# EAGLE board light_controller (EAGLE 8.5.0)
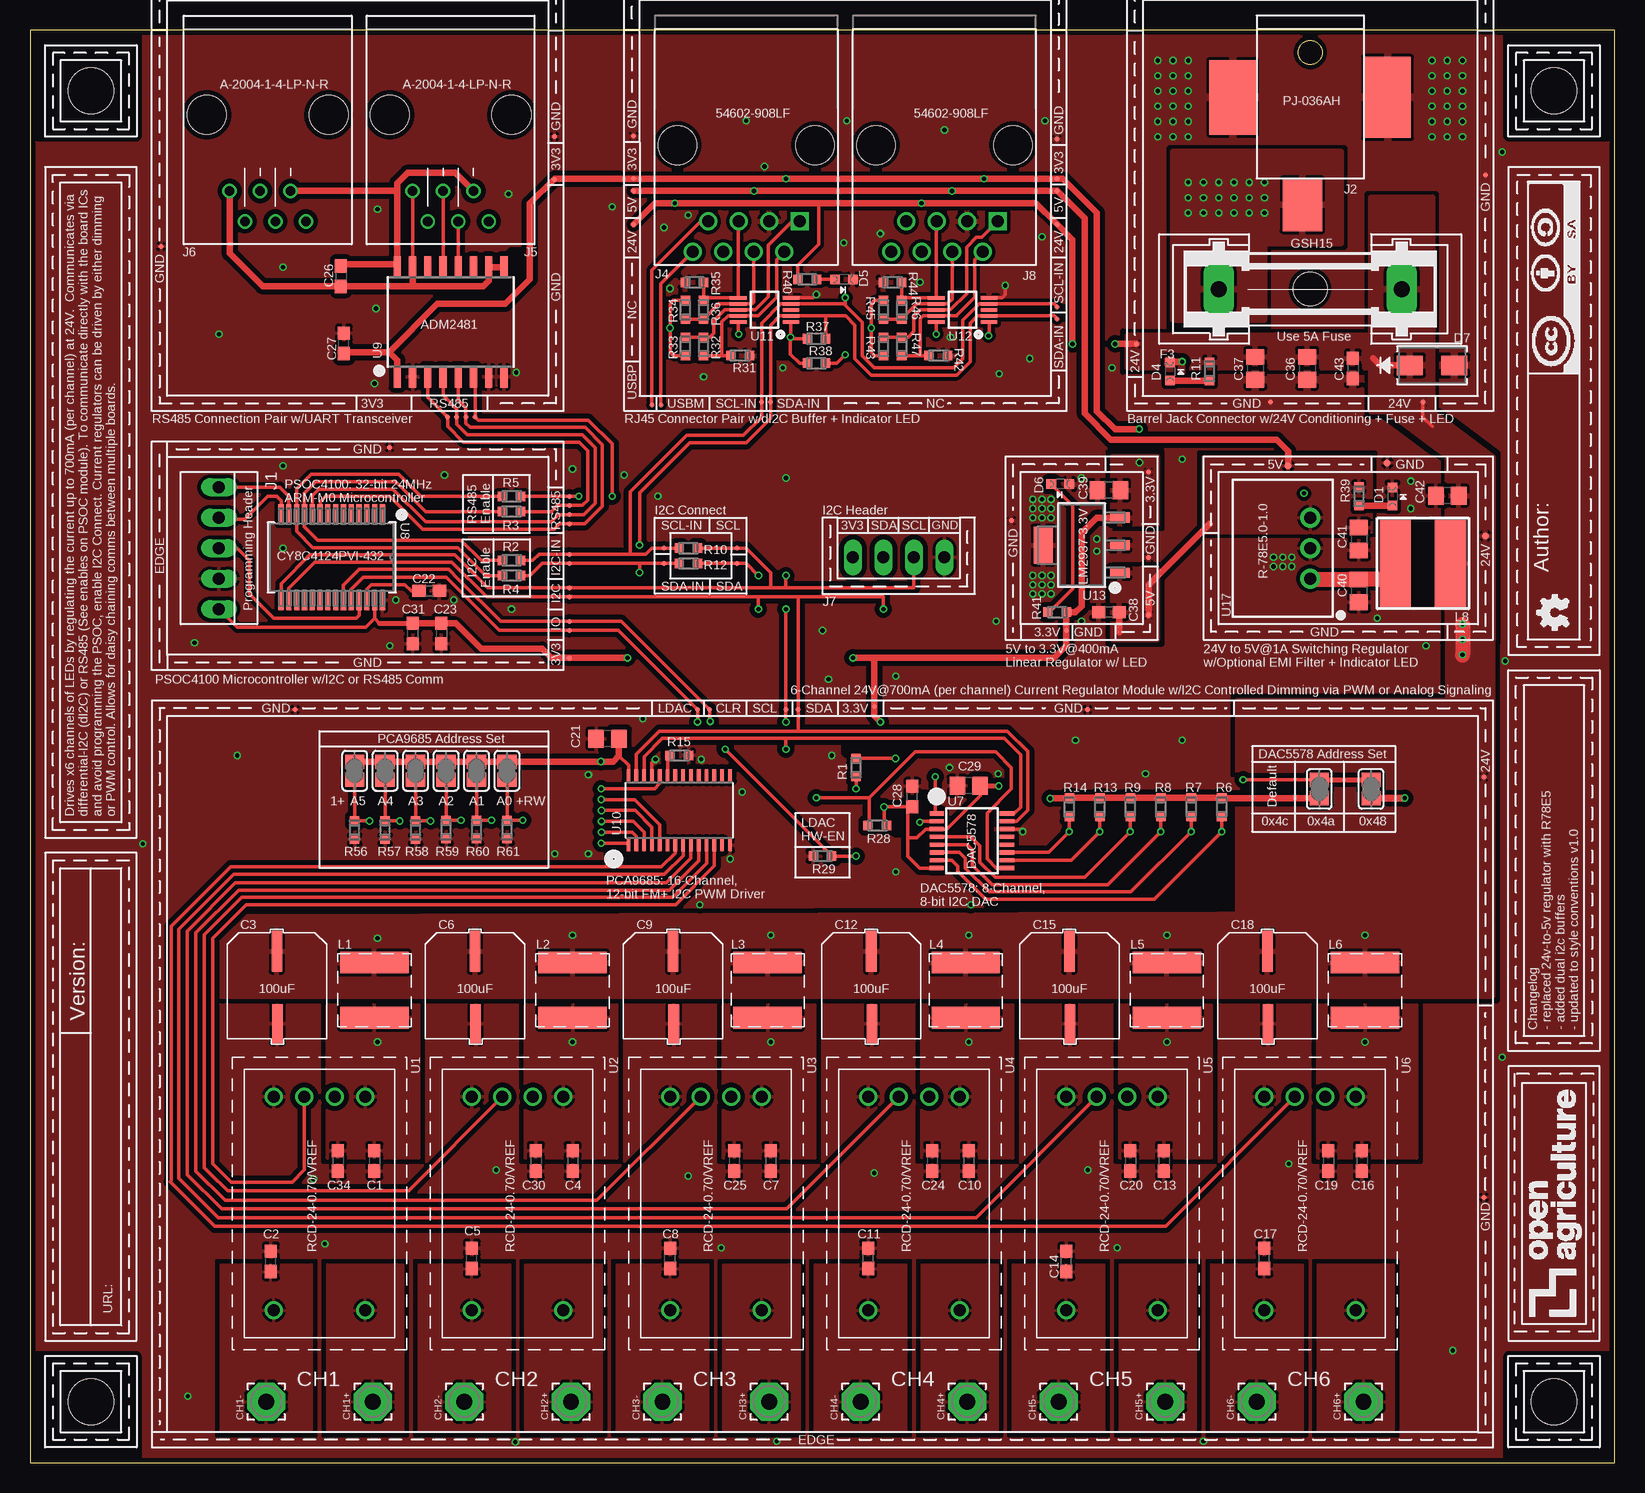
[diagram p2: board, top side]
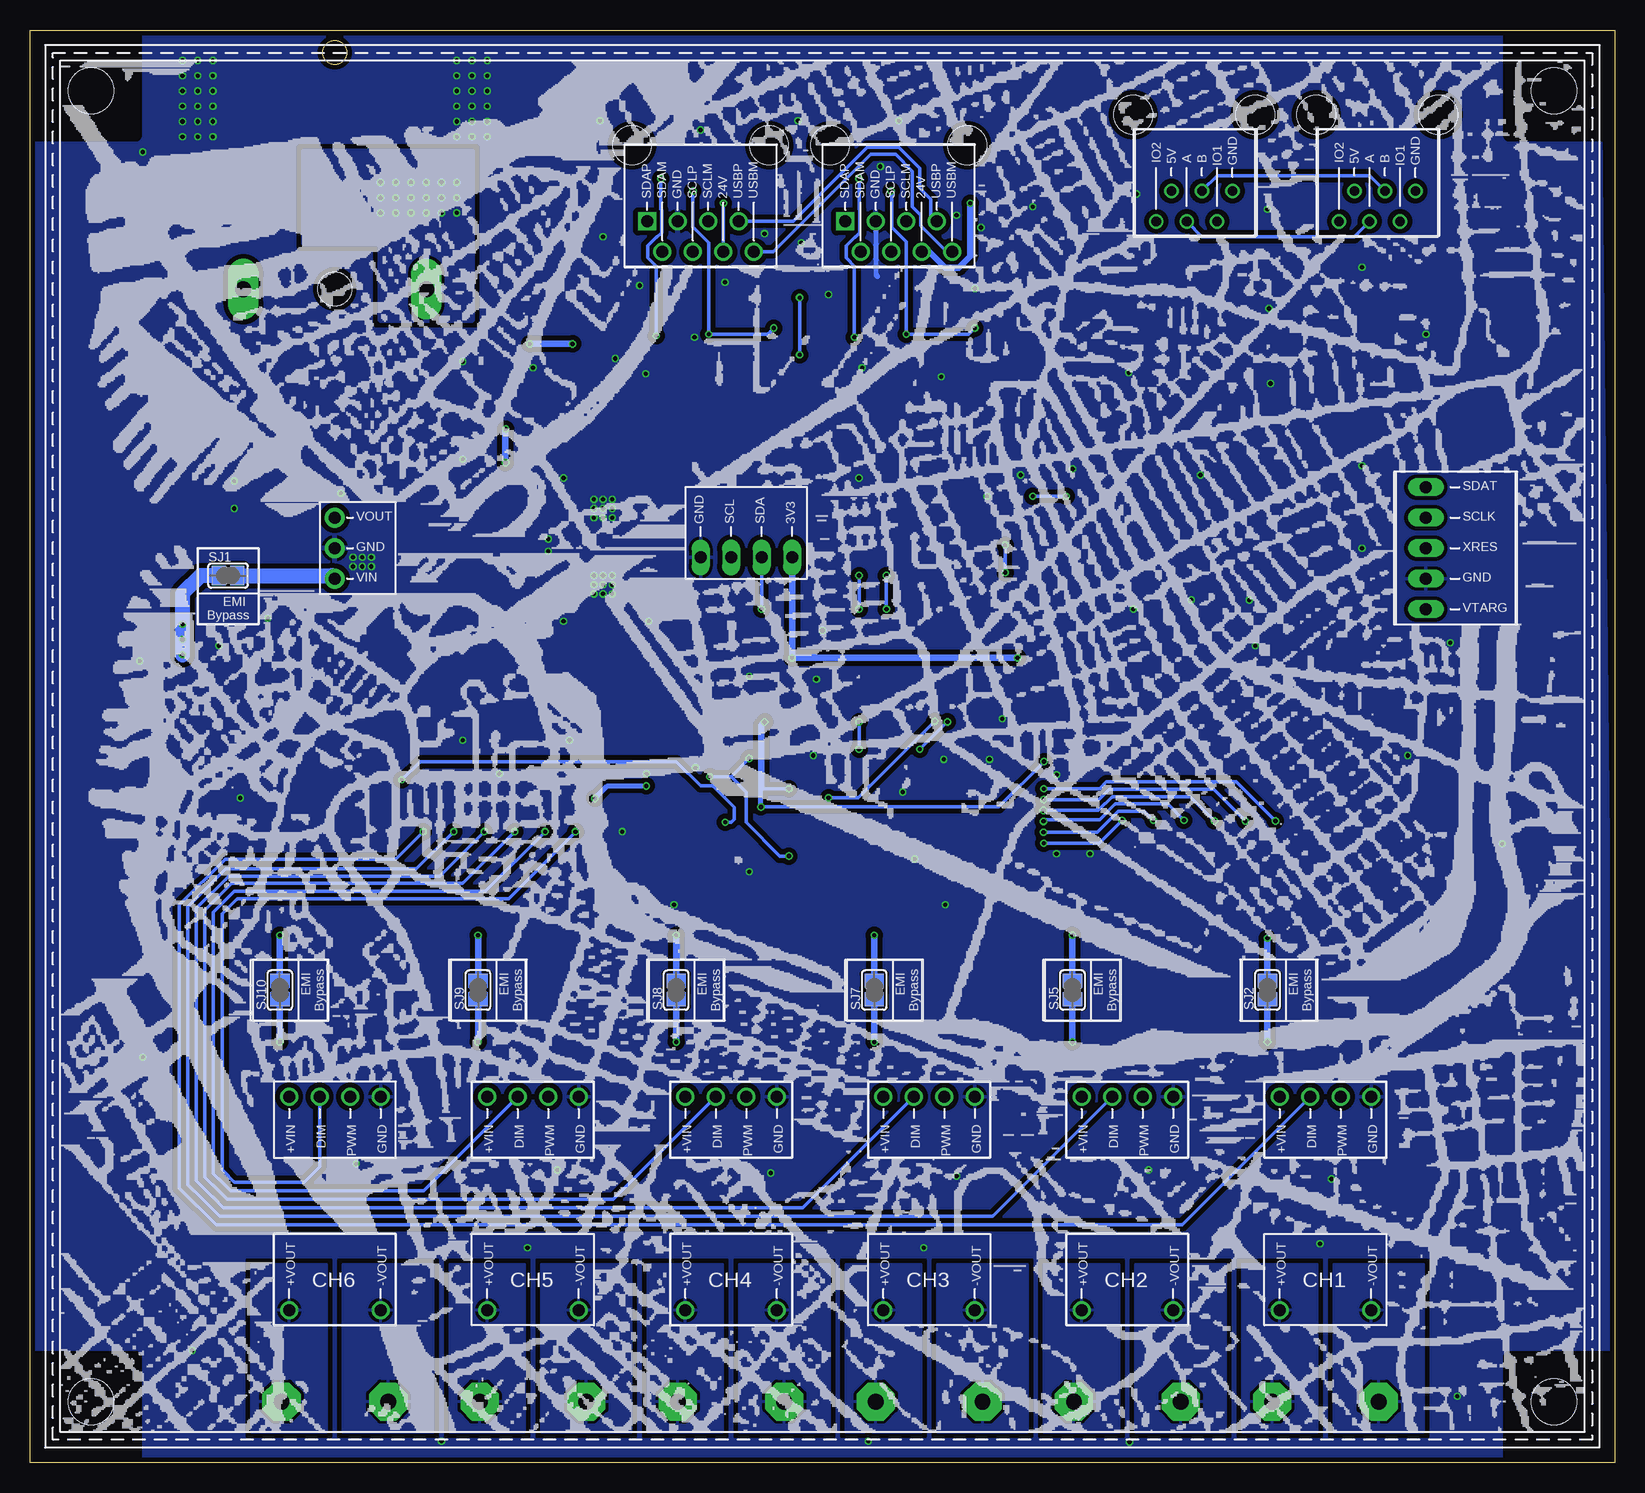
[diagram p3: board, bottom side, seen from below]

Size 132.08 x 119.38 mm. Coordinates in mm from the lower left corner, seen from the top.
Outline: 0,0 132.08,0 132.08,119.38 0,119.38 0,0
Copper layers (1*16): Top 0.035559375mm / dielectric 1.6mm / Bottom 0.035559375mm
Design rules "oshpark-2layer-mask": minimum track width 6mil, minimum drill 10mil, track to track 6mil, track to pad 6mil, pad to pad 6mil, via to via 6mil, smd to smd 6mil, copper to edge 15mil, drill to drill 6mil, minimum pad ring 5mil, minimum via ring 5mil, stop-mask expansion 2.5mil, vias tented up to drill 20mil, thermal gap 10mil
tRestrict: 8 lines

## Footprints (pad centres in the part's own frame; a part is rotated, then mirrored left to right if it is on the bottom)
C0603 = smd 1.1 x 1: 1 -0.85,0; 2 0.85,0
EEE-1HA101UP = smd 0.889 x 3.404: + 0,-3.251 | smd 0.889 x 3.251: - -0.051,2.794
C0805 = smd 1.3 x 1.5: 1 -0.95,0; 2 0.95,0
3,17/1,3 = drill 1.321 pad 3.175 octagon: 1 0,0
CHIPLED_0603 = smd 0.8 x 0.8: A 0,-0.75; C 0,0.75
SMA = smd 2.18 x 1.63: 1 -1.857,0; 2 1.857,0
GSH15 = drill 1.321 pad 2.54 long: 1 -7.62,0; 2 7.62,0 | hole 2.794: 0,0
PSOC-PROGRAMMER-22-23-2051 = drill 1 long: 1 -5.08,0; 2 -2.54,0; 3 0,0; 4 2.54,0; 5 5.08,0
BARREL-JACK-PJ-036AH = smd 4.4 x 3.3: 1 2.2,-0.65 | smd 6.75 x 3.9: 2 -6.75,6.45 | smd 6.2 x 3.9: 3 -6.75,-6.45
RJ45-DI2C-USB-54602-908LF = drill 1: 24V(6) 1.905,8.89; DSCLM(5) 0.635,6.35; DSCLP(4) -0.635,8.89; DSDAM(2) -3.175,8.89; GND(3) -1.905,6.35; USBM(8) 4.445,8.89; USBP(7) 3.175,6.35 | drill 1 square: DSDAP(1) -4.445,6.35 | hole 3.2: -5.715,0; 5.715,0
RJ12-RS485--A-2004-1-4-LP-N-R = drill 0.8: 1 -8.89,-3.175; 2 -6.35,-1.905; 3 -8.89,-0.635; 4 -6.35,0.635; 5 -8.89,1.905; 6 -6.35,3.175 | hole 3.25: 0,-5.08; 0,5.08
HEADER-I2C = drill 1 long: 3V3 3.81,0.762; GND -3.81,0.762; SCL -1.27,0.762; SDA 1.27,0.762
74404064121 = smd 1.8 x 5.7: 1 -2.3,0; 2 2.3,0
29333C = smd 2.6 x 7.2: 1 -2.3,0; 2 2.3,0
RC0603N = smd 0.756 x 0.8: 1 -0.778,0; 2 0.778,0
EMI-BYPASS = smd 1.168 x 1.6: 1 -0.762,0.254; 2 0.762,0.254
SJ1 = smd 1.168 x 1.6: 1 -0.762,0; 2 0.762,0
TP04R = smd 0.4 x 0.4: 1 0,0
TP06R = smd 0.6 x 0.6: TP 0,0
RCD-24-PINNED = drill 1: 1 0,0; 2 0,-2.54; 3 0,-5.08; 4 0,-7.62; 5 17.78,-7.62; 6 17.78,0
TSSOP16 = smd 0.35 x 1.2: 1 -2.275,-2.925; 2 -1.625,-2.925; 3 -0.975,-2.925; 4 -0.325,-2.925; 5 0.325,-2.925; 6 0.975,-2.925; 7 1.625,-2.925; 8 2.275,-2.925; 9 2.275,2.925; 10 1.625,2.925; 11 0.975,2.925; 12 0.325,2.925; 13 -0.325,2.925; 14 -0.975,2.925; 15 -1.625,2.925; 16 -2.275,2.925
SSOP-28 = smd 1.651 x 0.432: 1 -3.581,4.225; 2 -3.581,3.575; 3 -3.581,2.925; 4 -3.581,2.275; 5 -3.581,1.625; 6 -3.581,0.975; 7 -3.581,0.325; 8 -3.581,-0.325; 9 -3.581,-0.975; 10 -3.581,-1.625; 11 -3.581,-2.275; 12 -3.581,-2.925; 13 -3.581,-3.575; 14 -3.581,-4.225; 15 3.581,-4.225; 16 3.581,-3.575; 17 3.581,-2.925; 18 3.581,-2.275; 19 3.581,-1.625; 20 3.581,-0.975; 21 3.581,-0.325; 22 3.581,0.325; 23 3.581,0.975; 24 3.581,1.625; 25 3.581,2.275; 26 3.581,2.925; 27 3.581,3.575; 28 3.581,4.225
SOIC16LWB = smd 0.6 x 1.8: 1 -4.445,-4.575; 2 -3.175,-4.575; 3 -1.905,-4.575; 4 -0.635,-4.575; 5 0.635,-4.575; 6 1.905,-4.575; 7 3.175,-4.575; 8 4.445,-4.575; 9 4.445,4.575; 10 3.175,4.575; 11 1.905,4.575; 12 0.635,4.575; 13 -0.635,4.575; 14 -1.905,4.575; 15 -3.175,4.575; 16 -4.445,4.575
TSSOP28 = smd 0.305 x 0.991: 1 -4.225,-2.918; 2 -3.575,-2.918; 3 -2.925,-2.918; 4 -2.275,-2.918; 5 -1.625,-2.918; 6 -0.975,-2.918; 7 -0.325,-2.918; 8 0.325,-2.918; 9 0.975,-2.918; 10 1.625,-2.918; 11 2.275,-2.918; 12 2.925,-2.918; 13 3.575,-2.918; 14 4.225,-2.918; 15 4.225,2.918; 16 3.575,2.918; 17 2.925,2.918; 18 2.275,2.918; 19 1.625,2.918; 20 0.975,2.918; 21 0.325,2.918; 22 -0.325,2.918; 23 -0.975,2.918; 24 -1.625,2.918; 25 -2.275,2.918; 26 -2.925,2.918; 27 -3.575,2.918; 28 -4.225,2.918
SOP50P490X110-10N = smd 1.4 x 0.3: 1 -2.2,1; 2 -2.2,0.5; 3 -2.2,0; 4 -2.2,-0.5; 5 -2.2,-1; 6 2.2,-1; 7 2.2,-0.5; 8 2.2,0; 9 2.2,0.5; 10 2.2,1
MP04A = smd 1.6 x 0.838: 1 -3.2,2.3; 2 -3.2,0; 3 -3.2,-2.3 | smd 1.6 x 3.099: 4 3.2,0
R-78E5.0-1.0 = drill 1 pad 1.676: 1 -2.54,0; 2 0,0; 3 2.54,0
CORNER = hole 3.81: 0,0

## Placement (x,y rotation side)
C1  10nF  [C0603]  28.7,25.15 270 top
C2  10nF  [C0603]  20.07,16.76 90 top
C3  100uF  [EEE-1HA101UP]  20.57,39.37 180 top
C4  10nF  [C0603]  45.21,25.15 270 top
C5  10nF  [C0603]  36.83,17.02 90 top
C6  100uF  [EEE-1HA101UP]  37.08,39.37 180 top
C7  10nF  [C0603]  61.72,25.15 270 top
C8  10nF  [C0603]  53.34,17.02 90 top
C9  100uF  [EEE-1HA101UP]  53.59,39.37 180 top
C10  10nF  [C0603]  78.23,25.15 270 top
C11  10nF  [C0603]  69.85,17.02 90 top
C12  100uF  [EEE-1HA101UP]  70.1,39.37 180 top
C13  10nF  [C0603]  94.49,25.15 270 top
C14  10nF  [C0603]  86.36,16.76 90 top
C15  100uF  [EEE-1HA101UP]  86.61,39.37 180 top
C16  10nF  [C0603]  111,25.15 270 top
C17  10nF  [C0603]  102.87,17.02 90 top
C18  100uF  [EEE-1HA101UP]  103.12,39.37 180 top
C19  2.2uF  [C0603]  108.2,25.15 270 top
C20  2.2uF  [C0603]  91.69,25.15 270 top
C21  10uF  [C0805]  48.13,60.33 180 top
C22  1uF  [C0603]  33.27,72.64 0 top
C23  1uF  [C0603]  34.29,69.09 270 top
C24  2.2uF  [C0603]  75.18,25.15 270 top
C25  2.2uF  [C0603]  58.67,25.15 270 top
C26  0.1uF  [C0603]  25.91,98.86 270 top
C27  0.1uF  [C0603]  26.16,93.27 90 top
C28  0.1uF  [C0603]  73.53,55.5 90 top
C29  4.7uF  [C0805]  78.23,56.39 180 top
C30  2.2uF  [C0603]  42.16,25.15 270 top
C31  0.1uF  [C0603]  31.88,69.09 270 top
C34  2.2uF  [C0603]  25.65,25.15 270 top
C36  10uF  [C0805]  106.43,91.19 270 top
C37  4.7uF  [C0805]  102.11,91.19 270 top
C38  0.1uF  [C0603]  89.92,70.87 180 top
C39  10uF  [C0805]  89.92,81.03 180 top
C40  10uF  [C0805]  110.74,72.64 270 top
C41  10uF  [C0805]  110.74,76.96 270 top
C42  10uF  [C0805]  118.11,80.58 180 top
C43  0.1uF  [C0603]  110.24,91.19 270 top
CH1+  [3,17/1,3]  28.57,5.08 90 top
CH1-  [3,17/1,3]  19.68,5.08 90 top
CH2+  [3,17/1,3]  45.09,5.08 90 top
CH2-  [3,17/1,3]  36.2,5.08 90 top
CH3+  [3,17/1,3]  61.59,5.08 90 top
CH3-  [3,17/1,3]  52.7,5.08 90 top
CH4+  [3,17/1,3]  78.11,5.08 90 top
CH4-  [3,17/1,3]  69.22,5.08 90 top
CH5+  [3,17/1,3]  94.61,5.08 90 top
CH5-  [3,17/1,3]  85.72,5.08 90 top
CH6+  [3,17/1,3]  111.12,5.08 90 top
CH6-  [3,17/1,3]  102.23,5.08 90 top
D1  APT1608  [CHIPLED_0603]  113.54,80.52 0 top
D4  APT1608  [CHIPLED_0603]  95,90.93 0 top
D5  APT1608  [CHIPLED_0603]  67.82,98.6 270 top
D6  APT1608  [CHIPLED_0603]  85.85,81.53 270 top
D7  SMAJ26A  [SMA]  116.84,91.44 0 top
F3  GSH15  [GSH15]  106.68,97.79 0 top
J1  0022232051  [PSOC-PROGRAMMER-22-23-2051]  15.75,76.2 270 top
J2  PJ-036AH  [BARREL-JACK-PJ-036AH]  106.68,107.01 270 top
J4  54602-908LF  [RJ45-DI2C-USB-54602-908LF]  59.69,109.78 180 top
J5  A-2004-1-4-LP-N-R  [RJ12-RS485--A-2004-1-4-LP-N-R]  35.05,112.32 90 top
J6  A-2004-1-4-LP-N-R  [RJ12-RS485--A-2004-1-4-LP-N-R]  19.81,112.32 90 top
J7  I2C-HEADER  [HEADER-I2C]  72.39,76.2 180 top
J8  54602-908LF  [RJ45-DI2C-USB-54602-908LF]  76.2,109.78 180 top
L1  120uH  [74404064121]  28.7,39.37 270 top
L2  120uH  [74404064121]  45.21,39.37 270 top
L3  120uH  [74404064121]  61.47,39.37 270 top
L4  120uH  [74404064121]  77.98,39.37 270 top
L5  120uH  [74404064121]  94.74,39.37 270 top
L6  120uH  [74404064121]  111.25,39.37 270 top
L8  33uH  [29333C]  116.08,74.93 180 top
R1  1K  [RC0603N]  68.83,57.91 90 top
R2  0 OHM  [RC0603N]  40.13,75.18 0 top
R3  0 OHM  [RC0603N]  40.13,79.25 0 top
R4  0 OHM  [RC0603N]  40.13,73.91 0 top
R5  0 OHM  [RC0603N]  40.13,80.52 0 top
R6  1K  [RC0603N]  99.31,54.61 90 top
R7  1K  [RC0603N]  96.77,54.61 90 top
R8  1K  [RC0603N]  94.23,54.61 90 top
R9  1K  [RC0603N]  91.69,54.61 90 top
R10  0 OHM  [RC0603N]  54.86,76.2 0 top
R11  100  [RC0603N]  98.3,90.93 90 top
R12  0 OHM  [RC0603N]  54.86,74.93 0 top
R13  1K  [RC0603N]  89.15,54.61 90 top
R14  1K  [RC0603N]  86.61,54.61 90 top
R15  1K  [RC0603N]  54.1,58.93 0 top
R28  1K  [RC0603N]  70.61,53.09 180 top
R29  0 OHM  [RC0603N]  66.04,50.55 0 top
R31  600  [RC0603N]  59.18,92.25 0 top
R32  120  [RC0603N]  56.13,93.01 270 top
R33  600  [RC0603N]  54.61,93.01 90 top
R34  600  [RC0603N]  54.61,96.06 90 top
R35  600  [RC0603N]  55.37,98.35 0 top
R36  120  [RC0603N]  56.13,96.06 270 top
R37  10K  [RC0603N]  65.53,93.65 180 top
R38  10K  [RC0603N]  65.53,91.62 180 top
R39  100  [RC0603N]  110.74,80.52 90 top
R40  1K  [RC0603N]  64.77,98.6 180 top
R41  100  [RC0603N]  85.6,70.87 0 top
R42  600  [RC0603N]  75.69,92.25 0 top
R43  600  [RC0603N]  71.12,93.01 90 top
R44  600  [RC0603N]  71.88,98.35 0 top
R45  600  [RC0603N]  71.12,96.06 90 top
R46  120  [RC0603N]  72.64,96.06 270 top
R47  120  [RC0603N]  72.64,93.01 270 top
R56  1K  [RC0603N]  27.05,52.71 90 top
R57  1K  [RC0603N]  29.59,52.71 90 top
R58  1K  [RC0603N]  32.13,52.71 90 top
R59  1K  [RC0603N]  34.67,52.75 90 top
R60  1K  [RC0603N]  37.21,52.75 90 top
R61  1K  [RC0603N]  39.75,52.75 90 top
SJ1  [EMI-BYPASS]  115.57,73.66 0 bottom
SJ2  [EMI-BYPASS]  28.7,39.37 90 bottom
SJ5  [EMI-BYPASS]  44.96,39.37 90 bottom
SJ7  [EMI-BYPASS]  61.47,39.37 90 bottom
SJ8  [EMI-BYPASS]  77.98,39.37 90 bottom
SJ9  [EMI-BYPASS]  94.49,39.37 90 bottom
SJ10  [EMI-BYPASS]  111,39.37 90 bottom
SJ_A0  [SJ1]  39.75,57.65 270 top
SJ_A1  [SJ1]  37.21,57.65 270 top
SJ_A2  [SJ1]  34.67,57.65 270 top
SJ_A3  [SJ1]  32.13,57.65 270 top
SJ_A4  [SJ1]  29.59,57.65 270 top
SJ_A5  [SJ1]  27.05,57.65 270 top
SJ_A16  [SJ1]  107.44,56.13 90 top
SJ_A17  [SJ1]  111.76,56.13 90 top
TP1  TPTP04R  [TP04R]  116.08,88.39 0 top
TP2  TPTP04R  [TP04R]  103.38,88.39 0 top
TP3  TPTP04R  [TP04R]  58.93,76.2 0 top
TP4  TPTP04R  [TP04R]  58.93,74.93 0 top
TP5  TPTP04R  [TP04R]  52.83,76.2 0 top
TP6  TPTP04R  [TP04R]  52.83,74.93 0 top
TP7  TPTP04R  [TP04R]  10.92,101.35 0 top
TP8  TPTP04R  [TP04R]  44.96,69.34 0 top
TP9  TPTP04R  [TP04R]  29.97,84.58 0 top
TP10  TPTP04R  [TP04R]  43.69,110.49 0 top
TP11  TPTP04R  [TP04R]  44.96,80.52 0 top
TP12  TPTP04R  [TP04R]  121.16,57.15 90 top
TP13  TPTP04R  [TP04R]  70.36,62.99 90 top
TP14  TPTP04R  [TP04R]  22.1,62.74 90 top
TP15  TPTP04R  [TP04R]  64.01,62.74 90 top
TP16  TPTP04R  [TP04R]  62.99,62.74 90 top
TP17  TPTP04R  [TP04R]  55.63,62.74 90 top
TP18  TPTP04R  [TP04R]  44.96,72.14 0 top
TP19  TPTP04R  [TP04R]  44.96,67.06 0 top
TP20  TPTP04R  [TP04R]  44.96,79.76 0 top
TP21  TPTP04R  [TP04R]  44.96,78.99 0 top
TP22  TPTP04R  [TP04R]  44.96,78.23 0 top
TP23  TPTP04R  [TP04R]  44.96,70.1 0 top
TP24  TPTP04R  [TP04R]  44.96,72.9 0 top
TP25  TPTP04R  [TP04R]  44.96,74.93 0 top
TP26  TPTP04R  [TP04R]  44.96,75.69 0 top
TP27  TPTP04R  [TP04R]  43.69,106.93 0 top
TP28  TPTP04R  [TP04R]  37.08,87.12 270 top
TP29  TPTP04R  [TP04R]  34.8,87.12 270 top
TP30  TPTP04R  [TP04R]  35.56,87.12 270 top
TP31  TPTP04R  [TP04R]  36.32,87.12 270 top
TP32  TPTP04R  [TP04R]  56.64,62.74 90 top
TP33  TPTP04R  [TP04R]  88.14,62.74 0 top
TP34  TPTP04R  [TP04R]  121.16,22.1 0 top
TP35  TPTP04R  [TP04R]  121.28,107.31 0 top
TP36  TPTP04R  [TP04R]  92.2,93.22 0 top
TP40  TPTP04R  [TP04R]  50.29,106.98 270 top
TP41  TPTP04R  [TP04R]  50.29,105.97 270 top
TP42  TPTP04R  [TP04R]  50.29,110.54 270 top
TP43  TPTP04R  [TP04R]  50.29,103.17 270 top
TP44  TPTP04R  [TP04R]  61.72,88.39 270 top
TP45  TPTP04R  [TP04R]  60.96,88.39 270 top
TP46  TPTP04R  [TP04R]  51.82,88.14 270 top
TP47  TPTP04R  [TP04R]  52.58,88.14 270 top
TP48  TPTP04R  [TP04R]  85.6,106.98 270 top
TP49  TPTP04R  [TP04R]  85.6,105.97 270 top
TP50  TPTP04R  [TP04R]  85.6,103.17 270 top
TP51  TPTP04R  [TP04R]  85.6,110.29 270 top
TP52  TPTP04R  [TP04R]  85.6,96.32 270 top
TP53  TPTP04R  [TP04R]  85.6,95.3 270 top
TP54  TPTP06R  [TP06R]  104.84,83.06 90 top
TP55  TPTP06R  [TP06R]  121.28,77.22 90 top
TP56  TPTP06R  [TP06R]  113.09,83.31 90 top
TP57  TPTP04R  [TP04R]  86.36,69.34 90 top
TP58  TPTP04R  [TP04R]  93.22,70.61 90 top
TP59  TPTP04R  [TP04R]  81.79,78.49 90 top
TP60  TPTP04R  [TP04R]  93.22,82.55 90 top
TP61  TPTP04R  [TP04R]  93.22,75.44 90 top
U1  RCD-24-0.70/VREF  [RCD-24-PINNED]  27.94,30.48 270 top
U2  RCD-24-0.70/VREF  [RCD-24-PINNED]  44.45,30.48 270 top
U3  RCD-24-0.70/VREF  [RCD-24-PINNED]  60.96,30.48 270 top
U4  RCD-24-0.70/VREF  [RCD-24-PINNED]  77.47,30.48 270 top
U5  RCD-24-0.70/VREF  [RCD-24-PINNED]  93.98,30.48 270 top
U6  RCD-24-0.70/VREF  [RCD-24-PINNED]  110.49,30.48 270 top
U7  DAC5578  [TSSOP16]  78.49,51.82 270 top
U8  CY8C4124PVI-432  [SSOP-28]  25.15,75.44 270 top
U9  ADM2481  [SOIC16LWB]  35.05,95.05 0 top
U10  PCA9685  [TSSOP28]  54.1,54.36 0 top
U11  PCA9615  [SOP50P490X110-10N]  61.21,96.06 180 top
U12  PCA9615  [SOP50P490X110-10N]  77.72,96.06 180 top
U13  LM2937-3.3V  [MP04A]  87.63,76.45 180 top
U17  R-78E5.0-1.0  [R-78E5.0-1.0]  106.68,76.2 90 top
U$1  [CORNER]  5.08,5.08 0 top
U$2  [CORNER]  127,5.08 90 top
U$3  [CORNER]  5.08,114.3 270 top
U$4  [CORNER]  127,114.3 180 top
U$6  AUTHOR  [AUTHOR]  130.81,67.31 90 top
U$7  TITLE  [TITLE]  8.89,10.16 90 top
U$8  [LOGO]  130.81,10.16 90 top
U$9  [CAMBRIDGE-MAP-LIGHT-CONTROLLER-V-2-1]  1.27,1.27 0 top

## Tracks (layer width: path | path; a pad name or v marks a point on that pad's centre or on a via)
24V_EMI
  Top 1.27: U17.1 106.75,73.59 C40.1 112.44,73.59 arc90 L8.2
  Bottom 1.27: SJ1.2 106.93,73.91 U17.1
24V_IN  (via drill 0.35)
  other vias: 102.87,106.68 102.87,105.41 102.87,104.14 101.6,106.68 101.6,105.41 101.6,104.14 100.33,106.68 100.33,105.41 100.33,104.14 97.79,106.68 99.06,106.68 99.06,105.41 97.79,105.41 97.79,104.14 99.06,104.14 96.52,104.14 96.52,105.41 96.52,106.68
  pour Bottom (isolate 0.406): 102.87,95.25 95.25,95.25 95.25,109.22 109.22,109.22 109.22,101.6 102.87,101.6
  pour Top (isolate 0.406): 95.25,95.25 102.87,95.25 102.87,101.6 109.22,101.6 109.22,109.22 95.25,109.22
485_5V
  Top 0.559: J5.2 35.43,107.49 31.5,107.49 30.61,106.6 30.61,105.97 | 30.61,105.97 30.61,99.87 | 30.61,99.87 U9.16 | J6.2 30.61,105.97 | C26.1 26.07,99.87 30.61,99.87
485_A
  Top 0.305: U9.12 J5.3
  Bottom 0.305: J5.3 34.42,102.16 21.72,102.16 J6.3
485_B
  Top 0.305: 34.54,105.84 J5.4 U9.13
  Bottom 0.305: J6.4 20.45,107.24 33.15,107.24 J5.4
485_GND
  Top 0.305: J5.6 U9.15
  Top 0.559: J6.6 16.64,100.76 19.39,98.01 C26.2 | U9.9 U9.10 38.23,98.48 37.76,98.01 31.75,98.01 | 26.07,98.09 C26.2 | C26.2 31.75,98.01 | U9.15 31.88,98.13 31.75,98.01
!LDAC!  (via drill 0.35)
  Top 0.305: v75.44,57.15 75.43,56.38 75.43,54.22 U7.1 | 66.2,51.16 66.2,51.18 66.18,51.2 | 66.18,51.2 v57.94,59.44 | v72.13,58.68 v72.12,58.69 R1.2 | v55.63,61.72 TP17.1 49.02,69.34 TP8.1 39.12,69.34 35.13,73.33 34.7,73.76 27.77,73.76 26.77,72.77 U8.24 | 66.18,51.2 66.18,51.18 R29.2 v68.83,50.55
  Bottom 0.305: v68.83,50.55 69.6,50.55 72.39,53.34 72.39,55.88 73.66,57.15 | v72.13,58.68 73.66,57.15 | 73.66,57.15 v75.44,57.15 | v57.94,59.44 55.65,61.72 v55.63,61.72
+3V3  (via drill 0.35)
  Top 0.305: v71.17,54.63 71.17,53.3 R28.1 | R1.1 v68.83,56.15 | 73.15,52.07 73.15,50.55 74.16,49.54 U7.8 | 73.15,52.07 73.91,52.07 74.64,52.79 U7.3 76.41,52.79 79.18,55.56 C29.1 | v63.37,93.78 63.5,93.65 R37.2 | v79.88,93.9 79.92,93.94 U12.1 | v63.37,93.78 63.37,92.38 64.14,91.62 R38.2 | U8.27 28.72,70.34 | 28.72,70.34 29.12,69.94 | 28.72,70.34 27.98,69.6 17.27,69.6 J1.5 | U10.28 49.88,58.12 49.08,58.92 | U11.1 63.41,93.82 v63.37,93.78 | 73.15,52.07 73.15,54.27 C28.1 71.18,54.65
  Top 0.356: 71.18,54.65 v71.17,54.63
  Top 0.406: 27.02,58.45 SJ_A5.1 | v47.57,58.41 v47.57,58.42 | 107.44,55.39 SJ_A16.1 | 39.88,58.54 SJ_A0.1 | 29.12,69.94 C31.1 | C29.1 v80.72,56.39
  Top 0.559: v70.87,61.72 70.36,62.23 TP13.1 70.36,66.8 70.1,67.06 | SJ_A5.1 SJ_A4.1 SJ_A3.1 SJ_A2.1 SJ_A1.1 SJ_A0.1 v47.57,58.42 48.59,58.42 49.08,58.92 C21.1 | U9.1 30.61,91.87 29.93,92.55 | 107.43,55.39 SJ_A16.1 99.33,55.37 R6.2 R7.2 R8.2 R9.2 R13.2 R14.2 86.57,55.35 v85.01,55.35 | C31.1 C23.1 35.47,69.94 37.59,67.82 42.67,67.82 43.43,67.06 TP19.1 v49.78,67.06 | 29.93,92.55 26.29,92.55 C27.1 | U13.3 88.91,78.75 87.63,77.47 87.63,71.37 87.12,70.87 R41.2 86.36,70.85 TP57.1 86.36,68.07 85.34,67.06 70.1,67.06 | v68.58,67.06 70.1,67.06 | 29.93,92.55 33.96,96.57 39.62,96.57 41.66,98.6 41.66,104.95 TP27.1 43.74,106.98 TP40.1 v62.99,106.98 v79.5,106.98 TP48.1 86.06,106.98 88.9,104.14 88.9,87.63 90.42,86.11 92.41,86.11 v92.43,86.13
  Bottom 0.305: v47.57,58.42 51.36,54.63 v71.17,54.63 | v68.83,56.15 71.15,56.15 71.17,56.13 | v63.37,93.78 63.37,99.69 64.07,100.39 64.07,101.39 63.37,102.1 63.32,102.1 62.93,102.49 62.93,104.37 62.99,104.43 v62.99,106.98 | v79.5,106.98 79.5,104.43 79.44,104.37 79.44,102.49 79.83,102.1 79.88,102.1 80.58,101.39 80.58,100.39 79.88,99.69 v79.88,93.9
  Bottom 0.406: v71.17,54.63 71.17,56.13 | v80.72,56.39 83.97,56.39 v85.01,55.35
  Bottom 0.559: 71.15,56.15 71.15,61.43 v70.87,61.72 | v49.78,67.06 v68.58,67.06 J7.3V3 | v92.46,83.33 92.46,86.11 v92.43,86.13
  pour Top (isolate 0.305): 93.98,83.82 90.17,83.82 90.17,78.23 93.98,78.23
+5V  (via drill 0.35)
  Top 0.305: v75.51,94.03 75.52,94.04 U12.10 | R45.2 70.37,96.84 70.1,96.57 v70.1,94.54 70.1,92.51 70.37,92.24 R43.1 | v59.05,94.03 59.01,94.07 U11.10 | R34.2 53.61,96.84 53.34,96.57 v53.34,94.54 53.34,92.51 53.61,92.24 R33.1
  Top 0.559: TP41.1 v60.33,105.97 v76.83,105.97 TP49.1 87.88,103.68 87.88,87.42 90.07,85.24 103.89,85.24 104.84,84.29 TP54.TP | 90.77,69.18 C38.1 | TP58.1 93.22,73.15 98.3,78.23
  Bottom 0.305: v70.1,94.54 70.61,94.03 v75.51,94.03 75.51,101.67 76.83,102.99 v76.83,105.97 | v60.33,105.97 60.26,105.91 60.26,102.93 59.05,101.72 v59.05,94.03 53.85,94.03 v53.34,94.54
  pour Top (isolate 0.305): 97.79,83.82 111.76,83.82 111.76,77.47 97.79,77.47
  pour Top (isolate 0.305): 93.98,68.58 93.98,74.42 90.17,74.42 90.17,68.58
+24V  (via drill 0.35)
  Top 0.305: 57.78,104.83 57.66,104.95 | 65.72,104.95 65.72,101.52 63.99,99.79 R40.2 | TP1.1 116.08,87.12 116.84,86.36
  Top 0.559: TP43.1 52.07,104.95 v53.72,104.95 57.66,104.95 65.72,104.95 v74.3,104.95 83.82,104.95 TP50.1 86.87,101.91 v86.87,93.22 | 106.53,92.04 C36.1 | 98.31,91.69 R11.2 | D7.1 112.52,91.44 111.93,92.04 | v90.42,93.22 TP36.1
  Top 1.27: v119.38,69.85 v119.38,67.31
  Bottom 0.305: J8.24V(6) v74.3,104.95
  Bottom 0.559: 28.45,40.39 SJ2.2 v28.96,43.69 | SJ10.2 v111.25,43.94 | SJ9.2 v94.74,43.94 | v78.23,43.94 SJ8.2 | v61.72,43.94 SJ7.2 | v45.21,43.94 SJ5.2 | v53.72,104.95 53.72,100.52 54.69,99.56 55.8,99.56 57.13,100.89 J4.24V(6) | v86.87,93.22 v90.42,93.22
  Bottom 1.27: SJ1.1 117.86,73.91 119.38,72.39 v119.38,69.85 v119.38,67.31
  other vias: 119.38,68.58
  pour Top (isolate 0.406): 115.57,38.86 115.57,45.72 15.88,45.47 15.88,38.86
  pour Top (isolate 0.406): 100.58,63.5 100.58,38.86 121.92,38.86 121.92,63.5
  pour Top (isolate 0.406): 118.11,83.82 121.92,83.82 121.92,68.58 118.11,68.58
  pour Top (isolate 0.406): 121.92,63.5 121.92,68.58 118.11,68.58 118.11,63.5
  pour Top (isolate 0.406): 116.84,87.63 116.84,105.41 111.76,105.41 111.76,87.63
  pour Top (isolate 0.406): 121.92,83.82 116.84,87.63 113.03,87.63 118.11,83.82
  pour Top (isolate 0.406): 112.27,92.71 112.27,91.19 91.44,91.19 91.44,93.98 112.27,93.98
A0  (via drill 0.35)
  Top 0.305: SJ_A0.2 R61.2 v41.06,53.52 v41.07,53.52 | v47.6,51.61 49.88,51.61 U10.1
  Bottom 0.305: v47.6,51.61 42.98,51.61 v41.07,53.52
A1  (via drill 0.35)
  Top 0.305: SJ_A1.2 R60.2 38.45,53.52 v38.46,53.52 | v47.62,52.52 50.19,52.52 50.53,52.18 U10.2
  Bottom 0.305: v47.62,52.52 43.14,52.52 41.39,54.28 39.22,54.28 v38.46,53.52
A2  (via drill 0.35)
  Top 0.305: SJ_A2.2 R59.2 35.91,53.52 v35.92,53.52 | v47.62,53.43 50.28,53.43 51.18,52.53 U10.3
  Bottom 0.305: v47.62,53.43 47.48,53.58 42.95,53.58 41.64,54.89 37.28,54.89 v35.92,53.52
A3  (via drill 0.35)
  Top 0.305: SJ_A3.2 R58.2 33.35,53.49 v33.38,53.47 | v47.62,54.34 50.44,54.34 51.83,52.95 U10.4
  Bottom 0.305: v47.62,54.34 43.05,54.34 41.89,55.5 35.41,55.5 v33.38,53.47
A4  (via drill 0.35)
  Top 0.305: SJ_A4.2 R57.2 | R57.2 29.69,53.39 | R57.2 30.79,53.49 v30.81,53.47 | v47.6,55.25 50.39,55.25 52.48,53.16 U10.5
  Bottom 0.305: v47.6,55.25 43,55.25 42.14,56.11 33.45,56.11 v30.81,53.47
A5  (via drill 0.35)
  Top 0.254: 26.88,53.49 R56.2
  Top 0.305: SJ_A5.2 27.05,53.66 26.88,53.49 | 27.15,53.39 R56.2 28.27,53.49 v28.3,53.47 | v47.6,56.16 52.05,56.16 52.48,56.59 U10.24
  Bottom 0.305: v47.6,56.16 42.95,56.16 42.4,56.72 31.54,56.72 v28.3,53.47
ADDR0  (via drill 0.35)
  Top 0.305: v101.09,56.9 SJ_A16.2 | v74.14,53.37 74.21,53.44 U7.2
  Top 0.406: SJ_A16.2 SJ_A17.2
  Bottom 0.305: v74.14,53.37 73.63,53.37 73.41,53.59 73.41,54.61 75.19,56.39 76.18,56.39 78.21,58.42 99.57,58.42 v101.09,56.9
CH1+
  pour Bottom (isolate 0.406): 24.77,2.54 24.77,16.51 31.11,16.51 31.11,2.54
  pour Top (isolate 0.406): 24.77,2.54 24.77,16.51 31.11,16.51 31.11,2.54
CH1-
  pour Top (isolate 0.406): 15.88,2.54 15.88,16.51 23.5,16.51 23.5,2.54
  pour Bottom (isolate 0.406): 15.88,2.54 15.88,16.51 23.5,16.51 23.5,2.54
CH2+
  pour Bottom (isolate 0.406): 41.27,2.54 41.27,16.51 47.62,16.51 47.62,2.54
  pour Top (isolate 0.406): 41.27,2.54 41.27,16.51 47.62,16.51 47.62,2.54
CH2-
  pour Top (isolate 0.406): 32.38,2.54 32.38,16.51 40.01,16.51 40.01,2.54
  pour Bottom (isolate 0.406): 32.38,2.54 32.38,16.51 40.01,16.51 40.01,2.54
CH3+
  pour Bottom (isolate 0.406): 57.78,2.54 57.78,16.51 64.14,16.51 64.14,2.54
  pour Top (isolate 0.406): 57.78,2.54 57.78,16.51 64.14,16.51 64.14,2.54
CH3-
  pour Top (isolate 0.406): 48.9,2.54 48.9,16.51 56.52,16.51 56.52,2.54
  pour Bottom (isolate 0.406): 48.9,2.54 48.9,16.51 56.52,16.51 56.52,2.54
CH4+
  pour Bottom (isolate 0.406): 74.3,2.54 74.3,16.51 80.64,16.51 80.64,2.54
  pour Top (isolate 0.406): 74.3,2.54 74.3,16.51 80.64,16.51 80.64,2.54
CH4-
  pour Top (isolate 0.406): 65.41,2.54 65.41,16.51 73.03,16.51 73.03,2.54
  pour Bottom (isolate 0.406): 65.41,2.54 65.41,16.51 73.03,16.51 73.03,2.54
CH5+
  pour Bottom (isolate 0.406): 90.81,2.54 90.81,16.51 97.16,16.51 97.16,2.54
  pour Top (isolate 0.406): 90.81,2.54 90.81,16.51 97.16,16.51 97.16,2.54
CH5-
  pour Top (isolate 0.406): 81.92,2.54 81.92,16.51 89.53,16.51 89.53,2.54
  pour Bottom (isolate 0.406): 81.92,2.54 81.92,16.51 89.53,16.51 89.53,2.54
CH6+
  pour Bottom (isolate 0.406): 107.31,2.54 107.31,16.51 113.67,16.51 113.67,2.54
  pour Top (isolate 0.406): 107.31,2.54 107.31,16.51 113.67,16.51 113.67,2.54
CH6-
  pour Top (isolate 0.406): 98.42,2.54 98.42,16.51 106.05,16.51 106.05,2.54
  pour Bottom (isolate 0.406): 98.42,2.54 98.42,16.51 106.05,16.51 106.05,2.54
DAC_!CLR!  (via drill 0.35)
  Top 0.305: 69.92,55.4 73.76,59.23 80.47,59.23 81.79,57.91 81.79,56.13 79.76,54.1 79.76,50.3 80.51,49.54 U7.9 | 69.92,55.4 v65.53,55.4 | 69.92,55.4 69.92,53.17 R28.2 | v56.69,61.77 56.64,61.81 TP32.1 49.28,70.1 TP23.1 39.22,70.1 35.74,73.58 35.74,73.59 34.91,74.42 27.43,74.42 26.12,73.11 U8.23
  Bottom 0.305: 65.51,55.37 v65.53,55.4 63.05,55.4 v56.69,61.77
DIM1  (via drill 0.35)
  Top 0.305: U7.7 76.81,50.19 77.32,49.68 77.32,49.29 79.67,46.94 93.67,46.94 v99.31,52.58 R6.1
  Bottom 0.305: v99.31,52.58 101.6,50.29 115.82,50.29 119.63,46.48 119.63,22.87 116.58,19.81 36.07,19.81 U1.2
DIM2  (via drill 0.35)
  Top 0.305: U7.6 77.43,50.84 77.93,50.34 77.93,49.54 79.92,47.55 91.75,47.55 v96.77,52.58 R7.1
  Bottom 0.305: v96.77,52.58 99.87,49.48 115.77,49.48 118.92,46.32 118.92,23.16 117.86,22.1 117.85,22.1 116.27,20.52 51.87,20.52 U2.2
DIM3  (via drill 0.35)
  Top 0.305: U7.5 78.1,51.49 78.54,51.05 78.54,49.79 80.17,48.16 89.81,48.16 v94.23,52.58 R8.1
  Bottom 0.305: v94.23,52.58 97.94,48.87 115.52,48.87 118.21,46.17 118.21,23.47 116.84,22.1 116.82,22.1 115.96,21.23 67.67,21.23 U3.2
DIM4  (via drill 0.35)
  Top 0.305: U7.4 78.42,52.14 79.15,51.41 79.15,50.05 80.42,48.77 87.88,48.77 v91.69,52.58 R9.1
  Bottom 0.305: v91.69,52.58 96.01,48.26 115.26,48.26 117.5,46.02 117.5,23.77 116.84,23.11 116.83,23.11 115.66,21.95 83.46,21.95 U4.2
DIM5  (via drill 0.35)
  Top 0.305: U7.10 86.77,50.19 v89.15,52.58 R13.1
  Bottom 0.305: v89.15,52.58 94.13,47.6 115.06,47.6 116.79,45.87 116.79,24.08 116.33,23.62 116.32,23.62 115.36,22.66 99.26,22.66 U5.2
DIM6  (via drill 0.35)
  Top 0.305: U7.11 84.88,50.84 v86.61,52.58 R14.1
  Bottom 0.305: v86.61,52.58 92.2,46.99 114.81,46.99 116.08,45.72 116.08,24.38 115.06,23.37 109.22,23.37 107.95,24.64 U6.2
DSCLM_1
  Top 0.305: 56.13,97.08 R36.1 56.17,96.94 56.29,97.06 U11.6 59.01,103.39 J4.DSCLM(5) | 56.13,97.08 56.13,98.33 R35.2 | 56.15,97.06 56.13,97.08
DSCLM_2
  Top 0.305: R44.2 72.64,98.33 R46.1 72.87,97.06 U12.6 75.52,103.39 J8.DSCLM(5)
DSCLP_1
  Top 0.305: R34.1 R36.2 57.41,96.56 U11.7 60.19,96.56 60.33,96.7 J4.DSCLP(4)
DSCLP_2
  Top 0.305: R45.1 R46.2 72.64,95.3 73.91,96.56 U12.7 76.45,96.56 76.83,96.95 J8.DSCLP(4)
DSDAM_1
  Top 0.305: R32.2 57.66,92.24 | 57.66,92.24 58.13,92.24 R31.1 | 57.66,92.24 57.66,95.05 58.17,95.56 U11.9 60.7,95.56 62.23,97.09 62.23,100.25 J4.DSDAM(2)
DSDAM_2
  Top 0.305: R42.1 74.17,92.25 | 74.17,92.25 74.17,95.3 74.43,95.56 U12.9 77.21,95.56 | 74.17,92.25 72.66,92.25 R47.2 | 77.21,95.56 77.22,95.56 | 77.21,95.56 78.74,97.09 78.74,100.25 J8.DSDAM(2)
DSDAP_1
  Top 0.305: R32.1 R33.2 | 56.13,93.86 R32.1 | R32.1 56.66,93.79 56.99,94.13 56.99,95.14 57.91,96.06 U11.8 60.45,96.06 61.53,97.14 61.53,101.46 63.5,103.43 J4.DSDAP(1)
DSDAP_3
  Top 0.305: R43.2 R47.1 73.17,93.79 73.66,94.28 73.66,95.56 74.17,96.06 U12.8 76.71,96.06 78.04,97.4 78.04,101.26 78.88,102.1 79.31,102.1 J8.DSDAP(1)
GND  (via drill 0.35)
  Top 0.254: 34.64,51.76 R59.1
  Top 0.305: U10.25 51.83,58.3 v52.12,58.6 | U7.14 82.52,52.79 v82.73,52.58 | U11.5 64.75,97.06 | 64.75,97.06 64.77,97.08 | 64.75,97.06 65.26,97.06 v65.53,97.33 | U12.5 81.01,97.06 81.28,97.33 v81.28,98.09
  Top 0.559: SJ_A17.1 v114.55,55.37 | D4.C 95.06,91.75 v96.01,91.75
  Bottom 0.406: J4.GND(3) 61.59,98.98 61.47,98.86
  other vias: 40.51,90.83 58.34,50.29 76.63,57.91 72.14,49.23 55.93,58.6 21.08,76.2 35.31,71.88 30.48,71.88 29.97,68.07 40.13,71.12 13.72,68.33 34.54,82.3 21.08,83.06 23.62,23.62 38.86,24.38 54.86,23.88 70.36,24.13 88.14,24.38 104.9,24.89 17.27,58.93 9.4,51.56 72.14,65.53 80.52,70.1 87.12,60.2 96.01,60.2 122.68,33.78 122.94,66.8 51.05,61.98 43.74,50.72 46.53,50.72 55.8,46.48 78.41,46.48 62.23,1.78 97.79,1.78 15.75,94.03 106.17,80.77 116.33,68.07 59.69,111.81 56.13,90.47 115.06,79.5 112.27,70.36 84.33,73.91 85.09,73.91 84.33,73.15 85.09,73.15 85.09,72.39 84.33,72.39 83.57,73.91 83.57,72.39 83.57,73.15 85.09,78.74 85.09,79.5 85.09,80.26 84.33,78.74 83.57,78.74 84.33,79.5 83.57,79.5 83.57,80.26 84.33,80.26 88.9,75.95 87.63,82.04 88.9,76.96 68.07,111.81 87.63,70.1 76.2,111.05 67.82,101.65 84.58,111.81 76.71,93.78 53.34,97.84 105.16,75.44 104.39,75.44 104.39,74.68 105.16,74.68 103.63,75.44 103.63,74.68 83.31,92 80.77,90.73 62.74,91.24 54.86,103.94 115.06,81.79 70.87,102.41 61.21,108 66.04,69.34 52.83,102.92 96.52,116.84 96.52,115.57 96.52,114.3 96.52,113.03 96.52,111.76 96.52,110.49 93.98,116.84 93.98,115.57 93.98,114.3 93.98,113.03 93.98,111.76 93.98,110.49 95.25,110.49 95.25,111.76 95.25,113.03 95.25,114.3 95.25,115.57 95.25,116.84 116.84,116.84 116.84,115.57 116.84,114.3 116.84,113.03 116.84,111.76 116.84,110.49 118.11,110.49 119.38,110.49 119.38,111.76 118.11,111.76 118.11,113.03 119.38,113.03 119.38,114.3 118.11,114.3 118.11,115.57 119.38,115.57 119.38,116.84 118.11,116.84 96.01,83.62 90.17,91.24 28.83,96.16 122.68,109.22 21.08,99.62 28.96,104.44 39.88,105.71 45.21,82.8 28.7,89.92 48.51,104.65 49.53,82.3 74.17,98.35 84.33,102.16 52.32,80.52 62.99,82.04 66.55,65.28 66.8,58.93 46.53,57.33 59.36,55.88 80.7,57.4 92.96,57.4 118.55,9.33 13.14,5.52 40.45,1.71 24.57,18.22 57.59,17.91 90.61,17.91
  pour Top (isolate 0.406, rank 3): 0,0 132.08,0 132.08,119.38 0,119.38
  pour Bottom (isolate 0.406, rank 3): 0,0 132.08,0 133.35,119.38 1.27,119.38
  pour Top (isolate 0.305, rank 2): 10.16,66.04 44.45,66.04 44.45,85.09 10.16,85.09
  pour Bottom (isolate 0.305): 44.45,85.09 10.16,85.09 10.16,66.04 44.45,66.04
  pour Top (isolate 0.406, rank 3): 81.28,68.58 93.98,68.58 93.98,83.82 81.28,83.82
  pour Top (isolate 0.305): 49.53,123.19 49.53,87.63 86.36,87.63 86.36,123.19
  pour Bottom (isolate 0.406): 49.53,87.63 86.36,87.63 86.36,123.19 49.53,123.19
  pour Top (isolate 0.305, rank 2): 97.79,83.82 121.92,83.82 121.92,68.58 97.79,68.58
  pour Bottom (isolate 0.406, rank 2): 97.79,68.58 121.92,68.58 121.92,83.82 97.79,83.82
  pour Bottom (isolate 0.406): 81.28,68.58 81.28,83.82 93.98,83.82 93.98,68.58
  pour Top (isolate 0.305, rank 2): 91.44,87.63 91.44,123.19 121.92,123.19 121.92,87.63
  pour Bottom (isolate 0.406, rank 2): 91.44,123.19 121.92,123.19 121.92,87.63 91.44,87.63
N$1
  Top 0.559: R39.1 113.51,79.74 D1.A
N$2
  Top 0.305: R40.1 D5.A
N$3
  Top 0.305: D6.A 86.89,79.74 86.89,72.81 84.95,70.87 R41.1
N$4
  Top 0.559: D4.A 95.02,90.15 R11.1
N$23
  Top 0.305: U8.26 28.07,72.78 28.45,73.15 31.24,73.15 31.75,72.64 C22.1
OE
  Top 0.305: U10.23 53.13,58.73 R15.1
PWM1
  Top 0.305: U10.12 57.03,49.72 53.79,46.48 18.03,46.48 15.24,43.69 15.24,24.89 16.76,23.37 21.84,23.37 22.86,24.38 U1.3
PWM2
  Top 0.305: U10.11 56.38,49.93 53.54,47.09 17.63,47.09 14.53,43.99 14.53,24.59 14.99,24.13 15,24.13 16.47,22.66 31.55,22.66 U2.3
PWM3
  Top 0.305: U10.10 55.73,50.14 53.29,47.7 17.38,47.7 13.82,44.14 13.82,24.29 16.27,21.84 47.24,21.84 U3.3
PWM4
  Top 0.305: U10.9 55.08,50.37 53.02,48.31 17.12,48.31 13.11,44.3 13.11,24 15.97,21.13 35.56,21.13 63.04,21.13 U4.3
PWM5
  Top 0.305: U10.8 54.43,50.58 52.87,49.02 16.97,49.02 12.39,44.45 12.39,23.7 15.68,20.42 78.84,20.42 U5.3
PWM6
  Top 0.305: U10.7 53.78,50.79 52.62,49.63 16.72,49.63 11.79,44.7 11.79,23.51 11.68,23.41 15.38,19.71 94.64,19.71 U6.3
SCB1_RX[0]_SCL[0]
  Top 0.305: R3.1 32.97,79.25 30.48,81.74 23.82,81.74 22.87,80.78 U8.11 22.87,77.97 23.98,76.86 35.91,76.86 37.59,75.18 R2.1
SCB1_TX[0]_SDA[0]
  Top 0.305: R5.1 32.56,80.52 30.73,82.35 23.42,82.35 22.22,81.15 U8.12 22.22,77.6 23.57,76.25 35.66,76.25 38,73.91 R4.1
SCL  (via drill 0.35)
  Top 0.305: 62.99,60.35 52.7,60.35 51.18,58.82 U10.26 | 62.99,60.35 81.2,60.35 82.55,59 82.55,54.61 82.03,54.09 U7.16 | R10.2 TP3.1 59.69,76.2 61.72,74.17 61.72,72.9 | v62.99,61.72 TP16.1 v62.99,71.12 | v62.99,59.44 62.99,60.35 | U8.15 20.92,73.25 23.32,75.64 35.41,75.64 38.15,72.9 TP24.1 61.72,72.9 | 61.72,72.9 62.99,72.9 | 62.99,72.9 73.66,72.9 J7.SCL | v62.99,73.91 62.99,72.9
  Bottom 0.305: v62.99,61.72 v62.99,59.44 | v62.99,71.12 v62.99,73.91
SCL_IN  (via drill 0.35)
  Top 0.305: R2.2 41.91,75.18 42.42,75.69 TP26.1 50.04,75.69 | R10.1 TP5.1 51.82,76.2 51.31,75.69 50.04,75.69 | 69.6,92 69.34,92.25 69.34,95.05 67.95,96.44 | 67.95,96.44 67.95,97.07 v67.94,97.08 | v67.94,92.32 67.25,91.62 R38.1 | 69.6,92 | 69.6,92 70.36,91.24 76.96,91.24 77.72,92 77.72,95.2 79.09,96.56 U12.4 85.35,96.56 TP52.1 | 67.95,96.44 67.83,96.56 U11.4 62.58,96.56 60.96,94.95 TP45.1 60.96,87.12 59.44,85.6 54.73,85.6 50.04,80.9 50.04,75.69
  Bottom 0.305: v67.94,97.08 v67.94,92.32
SDA  (via drill 0.35)
  Top 0.305: 64.01,60.96 52.45,60.96 50.53,59.03 U10.27 | 64.01,60.96 81.46,60.96 83.16,59.26 83.16,54.36 82.24,53.44 U7.15 81.77,53.44 81.79,53.46 | R12.2 TP4.1 59.69,74.93 v60.71,73.91 | 64.01,60.96 TP15.1 64.01,72.14 | U8.16 21.57,72.88 23.72,75.03 35.16,75.03 38.05,72.14 TP18.1 60.71,72.14 | 60.71,72.14 64.01,72.14 | 64.01,72.14 71.12,72.14 v71.12,71.12 | v60.71,71.12 60.71,72.14
  Bottom 0.305: v60.71,73.91 v60.71,71.12 | J7.SDA v71.12,71.12
SDA_IN  (via drill 0.35)
  Top 0.305: R4.2 41.66,73.91 42.67,74.93 TP25.1 50.8,74.93 | R12.1 TP6.1 50.8,74.93 | 66.29,95.56 67.96,95.56 68.73,94.79 68.73,92 70.11,90.63 77.22,90.63 78.33,91.75 78.33,94.95 78.95,95.56 U12.2 85.34,95.56 TP53.1 | R37.1 66.31,95.55 66.29,95.56 | 66.29,95.56 U11.2 62.49,95.56 61.72,94.79 TP44.1 61.72,87.02 59.69,84.99 54.99,84.99 50.8,80.8 v50.8,76.45 | v50.8,74.17 50.8,74.93
  Bottom 0.305: v50.8,76.45 v50.8,74.17
SWD_CLK[0]
  Top 0.305: U8.14 20.92,80.17 20.57,80.52 19.81,80.52 17.91,78.61 15.88,78.61 J1.2
SWD_IO[0]
  Top 0.305: U8.13 21.57,80.54 20.83,81.28 J1.1
UART_!RE!
  Top 0.305: U8.10 23.52,80.57 24.08,81.13 30.23,81.13 32.96,78.39 43.44,78.39 44.04,78.99 TP21.1 46.13,78.99 47.09,79.95 47.09,84.58 46.02,85.65 36.42,85.65 35.56,86.51 TP30.1 35.56,87.78 34.42,88.93 U9.4
UART_DE
  Top 0.305: U8.9 24.17,80.05 24.64,80.52 29.97,80.52 32.71,77.78 43.69,77.78 44.14,78.23 TP22.1 46.23,78.23 47.7,79.7 47.7,84.83 46.28,86.26 36.68,86.26 36.32,86.61 TP31.1 36.32,87.88 35.69,88.52 U9.5
UART_RX
  Top 0.305: R3.2 43.43,79.25 43.94,79.76 TP20.1 46.03,79.76 46.48,80.2 46.48,83.31 | 46.48,83.31 | 46.48,83.31 46.48,84.33 45.77,85.04 36.12,85.04 34.8,86.36 TP29.1 33.15,88.77 U9.3
UART_TX  (via drill 0.35)
  Top 0.305: R5.2 TP11.1 v45.72,80.52 | v48.51,80.52 48.51,84.88 46.53,86.87 37.34,86.87 TP28.1 37.08,90.34 U9.6
  Bottom 0.305: v45.72,80.52 v48.51,80.52
USBM
  Top 0.305: TP47.1 52.58,98.22 J4.USBM(8)
  Bottom 0.305: J8.USBM(8) 70.16,100.89 62.04,109.01 59.94,109.01 58.54,107.62 58.54,104.64 57.85,103.94 57.85,103.05 55.68,100.89 J4.USBM(8)
USBP
  Top 0.305: TP46.1 51.82,99.36 55.88,103.43 J4.USBP(7)
  Bottom 0.305: J4.USBP(7) 57.03,103.94 57.03,105.27 57.94,106.18 57.94,107.87 59.69,109.62 62.29,109.62 68.48,103.43 J8.USBP(7)
VIN1  (via drill 0.35)
  Bottom 0.559: SJ2.1 v28.96,35.05
  pour Top (isolate 0.406): 24.77,25.4 24.77,38.1 32.38,38.1 32.38,25.4
VIN2  (via drill 0.35)
  Bottom 0.559: SJ5.1 v45.21,35.05
  pour Top (isolate 0.406): 41.27,25.4 41.27,38.1 48.9,38.1 48.9,25.4
VIN3  (via drill 0.35)
  Bottom 0.559: SJ7.1 v61.72,35.05
  pour Top (isolate 0.406): 57.78,25.4 57.78,38.1 65.41,38.1 65.41,25.4
VIN4  (via drill 0.35)
  Bottom 0.559: SJ8.1 v78.23,35.05
  pour Top (isolate 0.406): 74.3,25.4 74.3,38.1 81.92,38.1 81.92,25.4
VIN5  (via drill 0.35)
  Bottom 0.559: v94.74,35.05 SJ9.1
  pour Top (isolate 0.406): 90.81,25.4 90.81,38.1 98.42,38.1 98.42,25.4
VIN6  (via drill 0.35)
  Bottom 0.559: v111.25,35.05 SJ10.1
  pour Top (isolate 0.406): 107.31,25.4 107.31,38.1 115.57,38.1 115.57,25.4
XRES
  Top 0.305: U8.25 27.42,70.6 27.18,70.36 20.32,70.36 18.29,72.39 18.29,75.18 17.27,76.2 J1.3

## Text on the board
tPlace: EDGE | EDGE | EDGE | GND | GND | GND | 3V3 | 3V3 | 3V3 | GND | 5V | 5V | 24V | 24V | GND | GND | NC | SCL-IN | SDA-IN | 24V | Use 5A Fuse | USBP | 3V3 | SCL-IN | GND | 24V | RS485 | USBM | SDA-IN | NC | RS485 Connection Pair w/UART Transceiver | RJ45 Connector Pair w/dI2C Buffer + Indicator LED | Barrel Jack Connector w/24V Conditioning + Fuse + LED | GND | 5V | GND | PSOC4100: 32-bit 24MHz / ARM-M0 Microcontroller | 3.3V | I2C Connect | I2C Header | RS485 / Enable | RS485 | SCL-IN | SCL | GND | GND | 24V | EDGE | I2C-IN | I2C / Enable | SDA-IN | SDA | I2C | Programming Header | 5V | 3.3V | GND | IO | GND | GND | 3V3 | 5V to 3.3V@400mA / Linear Regulator w/ LED | 24V to 5V@1A Switching Regulator / w/Optional EMI Filter + Indicator LED | PSOC4100 Microcontroller w/I2C or RS485 Comm | 6-Channel 24V@700mA (per channel) Current Regulator Module w/I2C Controlled Dimming via PWM or Analog Signaling | GND | LDAC | CLR | SCL | SDA | 3.3V | GND | PCA9685 Address Set | DAC5578 Address Set | 24V | 1+ | A5 | A4 | A3 | A2 | A1 | A0 | +RW | Default | Drives x6 channels of LEDs by regulating the current up to 700mA (per channel) at 24V. Communicates via / differential-I2C (dI2C) or RS485 (See enables on PSOC module). To communicate directly with the board ICs / and avoid programming the PSOC, enable I2C Connect. Current regulators can be driven by either dimming / or PWM control. Allows for daisy chaining comms between multiple boards. | 0x4c | 0x4a | 0x48 | LDAC / HW-EN | PCA9685: 16-Channel, / 12-bit FM+ I2C PWM Driver | DAC5578: 8-Channel, / 8-bit I2C DAC | Changelog / - replaced 24v-to-5v regulator with R78E5 / - added dual i2c buffers / - updated to style conventions v1.0 | GND | CH1 | CH2 | CH3 | CH4 | CH5 | CH6 | EDGE
bPlace: CH1 | CH2 | CH3 | CH4 | CH5 | CH6